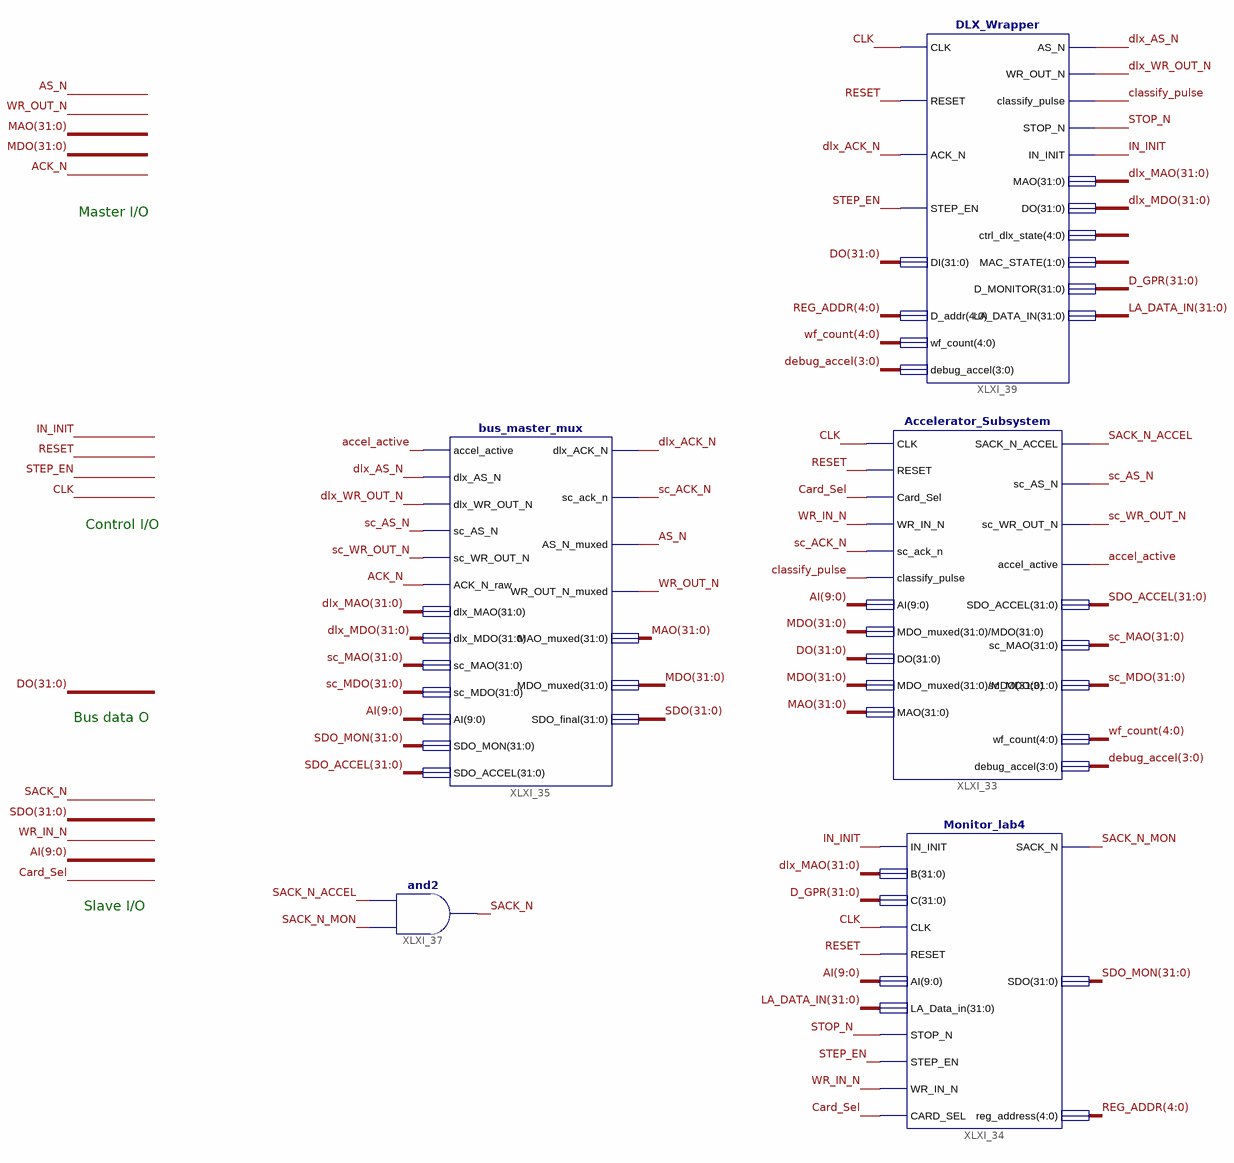
[diagram p0: schematic sheet 1]
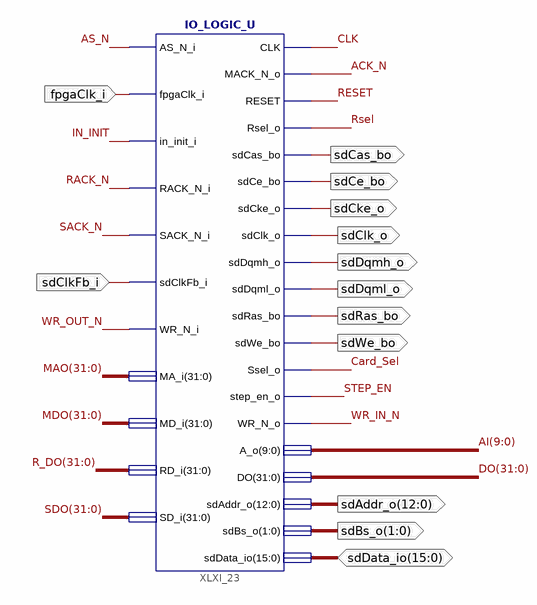
[diagram p1: schematic sheet 2]
// Xilinx ISE schematic Top_Level.sch (spartan6) as structural Verilog: 6 symbols, 13 ports
module Top_Level (
  input  fpgaClk_i,
  input  sdClkFb_i,
  inout  [15:0] sdData_io,
  output sdClk_o,
  output [1:0] sdBs_o,
  output sdDqml_o,
  output sdDqmh_o,
  output sdWe_bo,
  output sdCas_bo,
  output sdRas_bo,
  output sdCe_bo,
  output sdCke_o,
  output [12:0] sdAddr_o
);

  wire accel_active, ACK_N, AS_N, Card_Sel, classify_pulse, CLK, dlx_ACK_N, dlx_AS_N, dlx_WR_OUT_N, IN_INIT,
       RACK_N, RESET, Rsel, SACK_N, SACK_N_ACCEL, SACK_N_MON, sc_ACK_N, sc_AS_N, sc_WR_OUT_N, STEP_EN,
       STOP_N, WR_IN_N, WR_OUT_N;
  wire [1:0] XLXN_41;
  wire [3:0] debug_accel;
  wire [4:0] REG_ADDR, wf_count, XLXN_42;
  wire [9:0] AI;
  wire [31:0] D_GPR, dlx_MAO, dlx_MDO, DO, LA_DATA_IN, MAO, MDO, R_DO, sc_MAO, sc_MDO, SDO, SDO_ACCEL,
       SDO_MON;

  IO_LOGIC_U XLXI_23 (
    .AS_N_i(AS_N), .fpgaClk_i(fpgaClk_i), .in_init_i(IN_INIT), .RACK_N_i(RACK_N), .SACK_N_i(SACK_N),
    .sdClkFb_i(sdClkFb_i), .WR_N_i(WR_OUT_N), .MA_i(MAO), .MD_i(MDO), .RD_i(R_DO), .SD_i(SDO), .CLK(CLK),
    .MACK_N_o(ACK_N), .RESET(RESET), .Rsel_o(Rsel), .sdCas_bo(sdCas_bo), .sdCe_bo(sdCe_bo),
    .sdCke_o(sdCke_o), .sdClk_o(sdClk_o), .sdDqmh_o(sdDqmh_o), .sdDqml_o(sdDqml_o), .sdRas_bo(sdRas_bo),
    .sdWe_bo(sdWe_bo), .Ssel_o(Card_Sel), .step_en_o(STEP_EN), .WR_N_o(WR_IN_N), .A_o(AI), .DO(DO),
    .sdAddr_o(sdAddr_o), .sdBs_o(sdBs_o), .sdData_io(sdData_io));
  Accelerator_Subsystem XLXI_33 (
    .CLK(CLK), .RESET(RESET), .Card_Sel(Card_Sel), .WR_IN_N(WR_IN_N), .sc_ack_n(sc_ACK_N),
    .classify_pulse(classify_pulse), .AI(AI), .MDO_muxed(MDO), .DO(DO), .MDO(MDO), .MAO(MAO),
    .SACK_N_ACCEL(SACK_N_ACCEL), .sc_AS_N(sc_AS_N), .sc_WR_OUT_N(sc_WR_OUT_N), .accel_active(accel_active),
    .SDO_ACCEL(SDO_ACCEL), .sc_MAO(sc_MAO), .sc_MDO(sc_MDO), .wf_count(wf_count), .debug_accel(debug_accel));
  bus_master_mux XLXI_35 (
    .accel_active(accel_active), .dlx_AS_N(dlx_AS_N), .dlx_WR_OUT_N(dlx_WR_OUT_N), .sc_AS_N(sc_AS_N),
    .sc_WR_OUT_N(sc_WR_OUT_N), .ACK_N_raw(ACK_N), .dlx_MAO(dlx_MAO), .dlx_MDO(dlx_MDO), .sc_MAO(sc_MAO),
    .sc_MDO(sc_MDO), .dlx_ACK_N(dlx_ACK_N), .sc_ack_n(sc_ACK_N), .AS_N_muxed(AS_N),
    .WR_OUT_N_muxed(WR_OUT_N), .MAO_muxed(MAO), .MDO_muxed(MDO), .AI(AI), .SDO_MON(SDO_MON),
    .SDO_ACCEL(SDO_ACCEL), .SDO_final(SDO));
  and XLXI_37 (SACK_N, SACK_N_MON, SACK_N_ACCEL);
  Monitor_lab4 XLXI_34 (
    .IN_INIT(IN_INIT), .B(dlx_MAO), .C(D_GPR), .CLK(CLK), .RESET(RESET), .AI(AI), .LA_Data_in(LA_DATA_IN),
    .STOP_N(STOP_N), .STEP_EN(STEP_EN), .WR_IN_N(WR_IN_N), .CARD_SEL(Card_Sel), .SACK_N(SACK_N_MON),
    .SDO(SDO_MON), .reg_address(REG_ADDR));
  DLX_Wrapper XLXI_39 (
    .CLK(CLK), .RESET(RESET), .ACK_N(dlx_ACK_N), .STEP_EN(STEP_EN), .DI(DO), .D_addr(REG_ADDR),
    .wf_count(wf_count), .debug_accel(debug_accel), .AS_N(dlx_AS_N), .WR_OUT_N(dlx_WR_OUT_N),
    .classify_pulse(classify_pulse), .STOP_N(STOP_N), .IN_INIT(IN_INIT), .MAO(dlx_MAO), .DO(dlx_MDO),
    .ctrl_dlx_state(XLXN_42), .MAC_STATE(XLXN_41), .D_MONITOR(D_GPR), .LA_DATA_IN(LA_DATA_IN));

  // Notes on the sheet:
  //   Master I/O
  //   Control I/O
  //   Bus data O
  //   Slave I/O
endmodule
